# EAGLE design wifi Shield V1.0 (EAGLE 6.1)
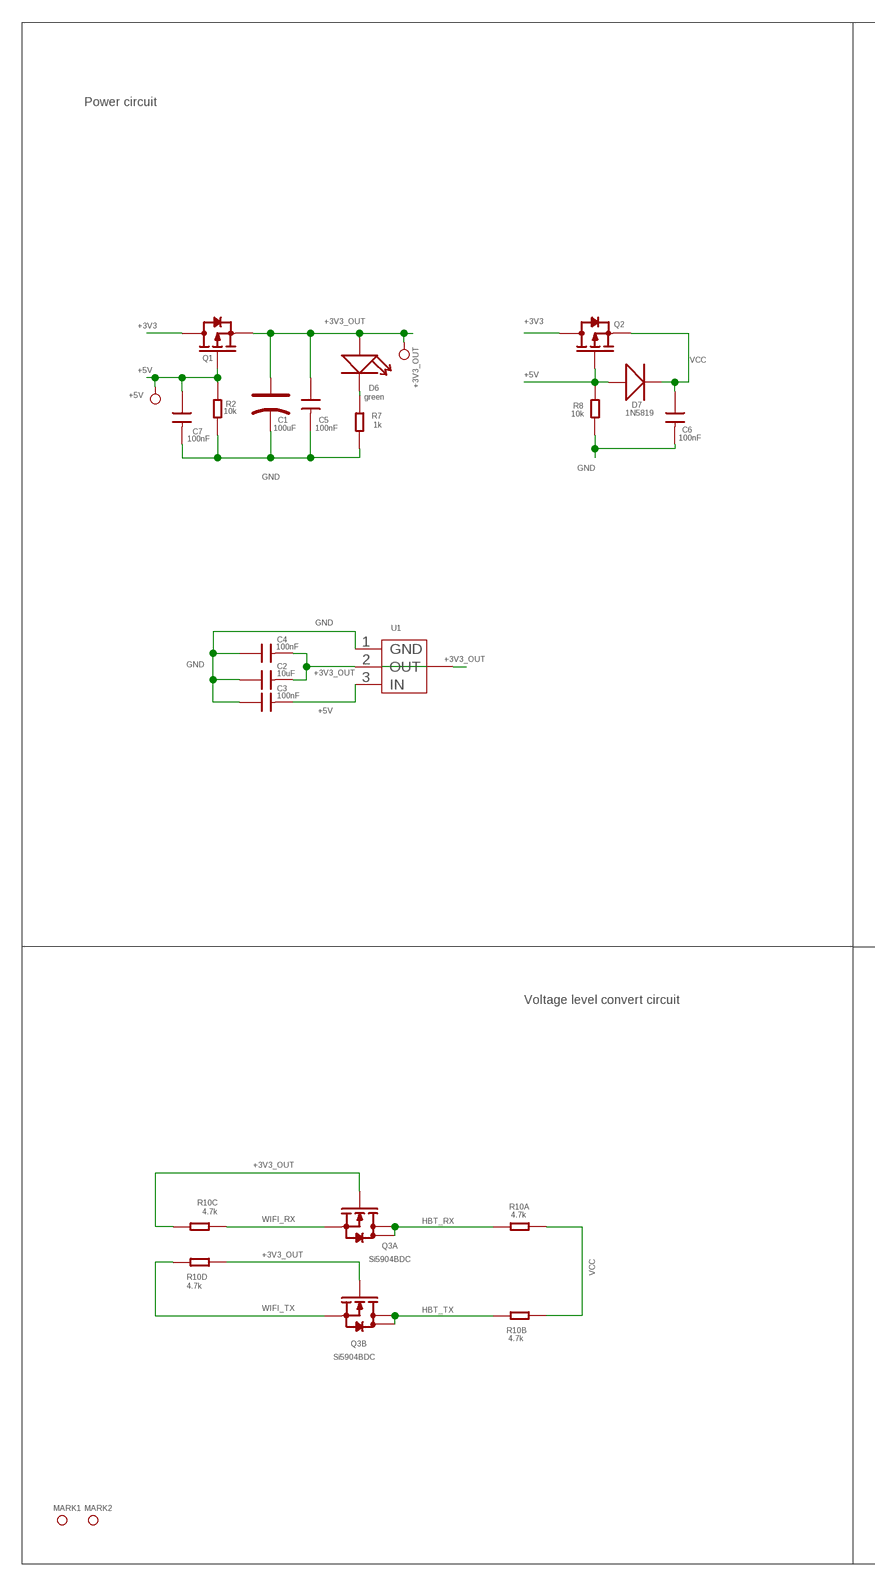
[diagram p0: schematic, sheet 1, part 1 of 2]
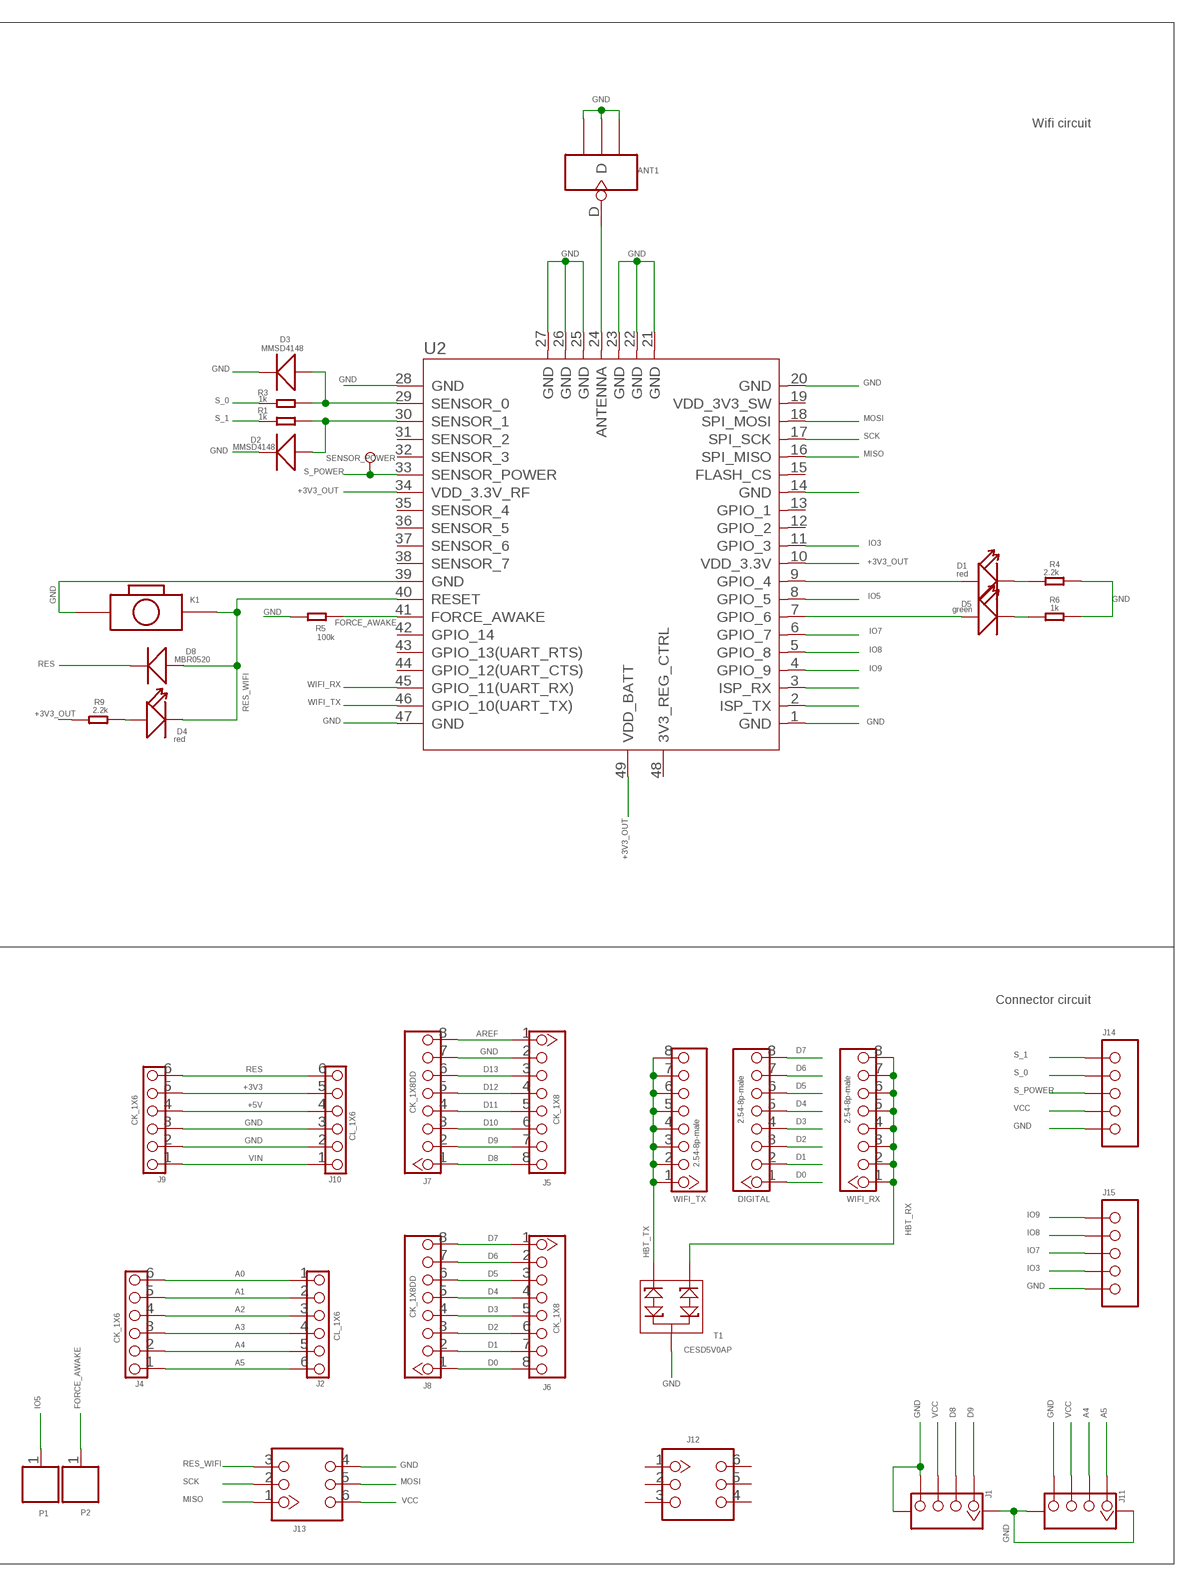
[diagram p1: schematic, sheet 1, part 2 of 2]

## Parts
+3V3_OUT  PAD-TEST-POINT-CIRCLE_SIZE_3030  [TP_3535]
+5V  PAD-TEST-POINT-CIRCLE_SIZE_3030  [TP_3535]
ANT1  ANTENNA-U-FL  [4P-U-FL]
C1  100uF  CAP-AVX-B  [AVX-B]
C2  10uF  C-0603  [0603]
C3  100nF  C-0603  [0603]
C4  100nF  C-0603  [0603]
C5  100nF  C-0603  [0603]
C6  100nF  C-0603  [0603]
C7  100nF  C-0603  [0603]
D1  red  LED'0603'  [LED-0603]
D2  MMSD4148  D-MBR0520LT1  [SOD123-2.7X1.6]
D3  MMSD4148  D-MBR0520LT1  [SOD123-2.7X1.6]
D4  red  LED'0603'  [LED-0603]
D5  green  LED'0603'  [LED-0603]
D6  green  LED'0603'  [LED-0603]
D7  1N5819  D-SMA  [D2010]
D8  MBR0520  D-MBR0520LT1  [SOD123-2.7X1.6]
DIGITAL  2.54-8p-male  HEADER-8P-2.54  [8P-2.54]
J1  TWIG-4P-2.0-SMD-FEMALE-REINFORCE'90D'  [4P-SMD-2.0-90D]
J2  CL_1X6  HEADER-6P-65/35MIL  [6P-2.54-65/35MIL]
J4  CK_1X6  HEADER-6P-65/35MIL  [6P-2.54-65/35MIL]
J5  CK_1X8  HEADER-8P-2.54  [8P-2.54]
J6  CK_1X8  HEADER-8P-2.54  [8P-2.54]
J7  CK_1X8DD  HEADER-8P-2.54  [8P-2.54]
J8  CK_1X8DD  HEADER-8P-2.54  [8P-2.54]
J9  CK_1X6  HEADER-6P-65/35MIL  [6P-2.54-65/35MIL]
J10  CL_1X6  HEADER-6P-65/35MIL  [6P-2.54-65/35MIL]
J11  TWIG-4P-2.0-SMD-FEMALE-REINFORCE'90D'  [4P-SMD-2.0-90D]
J12  HEADER-2X3P-2.54  [2X3P-2.54]
J13  HEADER-2X3P-2.54  [2X3P-2.54]
J14  HEADER-5P-2.54  [5P-2.54]
J15  HEADER-5P-2.54  [5P-2.54]
K1  BOTTON-2P-90  [2P-7.62X3.56-90D]
MARK1  PAD-MARK  [ROUND-MARK-0.635]
MARK2  PAD-MARK  [ROUND-MARK-0.635]
P1  PAD'60/30'  [1P-65/35MIL]
P2  PAD'60/30'  [1P-65/35MIL]
Q1  MOSFET-P'SI2323CDS/SI2305DS<BR>'  [SOT23]
Q2  MOSFET-P'SI2323CDS/SI2305DS<BR>'  [SOT23]
Q3  Si5904BDC  010-DUAL-N-MOSFET_1206-8  [1206-8]
R1  1k  R-0603  [0603]
R2  10k  R-0603  [0603]
R3  1k  R-0603  [0603]
R4  2.2k  R-0603  [0603]
R5  100k  R-0603  [0603]
R6  1k  R-0603  [0603]
R7  1k  R-0603  [0603]
R8  10k  R-0603  [0603]
R9  2.2k  R-0603  [0603]
R10  4.7k  005-4R_1206  [R1206-8]
SENSOR_POWER  PAD-TEST-POINT-CIRCLE_SIZE_3030  [TP_3535]
T1  CESD5V0AP  D-ESD-PESDXL2BT  [SOT23]
U1  LD1117SOT89  [SOT89]
U2  WIFI-RN-171  [49P-1.27-26.67X17.78]
WIFI_RX  2.54-8p-male  HEADER-8P-2.54  [8P-2.54]
WIFI_TX  2.54-8p-male  HEADER-8P-2.54  [8P-2.54]

## Nets
+3V3: J9.5 J10.5 Q1.3(D) Q2.3(D)
+3V3_OUT: +3V3_OUT.T C1.+ C2.2 C4.2 C5.1 D6.+ Q1.2(S) Q3.2(A:G) Q3.4(B:G) R9.2 R10.5 R10.6 U1.2(OUT) U1.4(TAB) U2.10(VDD_3.3V) U2.34(VDD_3.3V_RF) U2.49(VDD_BATT)
+5V: +5V.T C3.2 C7.1 D7.+ J9.4 J10.4 Q1.1(G) Q2.1(G) R2.1 R8.1 U1.3(IN)
A0: J2.1 J4.6
A1: J2.2 J4.5
A2: J2.3 J4.4
A3: J2.4 J4.3
A4: J2.5 J4.2 J11.2
A5: J2.6 J4.1 J11.1
AREF: J5.1 J7.8
D0: DIGITAL.1 J6.8 J8.1
D1: DIGITAL.2 J6.7 J8.2
D2: DIGITAL.3 J6.6 J8.3
D3: DIGITAL.4 J6.5 J8.4
D4: DIGITAL.5 J6.4 J8.5
D5: DIGITAL.6 J6.3 J8.6
D6: DIGITAL.7 J6.2 J8.7
D7: DIGITAL.8 J6.1 J8.8
D8: J1.2 J5.8 J7.1
D9: J1.1 J5.7 J7.2
D10: J5.6 J7.3
D11: J5.5 J7.4
D12: J5.4 J7.5
D13: J5.3 J7.6
FORCE_AWAKE: P2.1 R5.1 U2.41(FORCE_AWAKE)
GND: ANT1.GND1 ANT1.GND2 ANT1.GND3 C1.- C2.1 C3.1 C4.1 C5.2 C6.2 C7.2 D2.1(-) D3.1(-) J1.4 J1.SS1 J1.SS2 J5.2 J7.7 J9.2 J9.3 J10.2 J10.3 J11.4 J11.SS1 J11.SS2 J13.4 J14.5 J15.5 K1.P$2 R2.2 R4.1 R5.2 R6.1 R7.1 R8.2 T1.3 U1.1(GND) U2.1(GND) U2.14(GND) U2.20(GND) U2.21(GND) U2.22(GND) U2.23(GND) U2.25(GND) U2.26(GND) U2.27(GND) U2.28(GND) U2.39(GND) U2.47(GND)
HBT_RX: Q3.7(A:D) Q3.8(A:D) R10.1 T1.1 WIFI_RX.1 WIFI_RX.2 WIFI_RX.3 WIFI_RX.4 WIFI_RX.5 WIFI_RX.6 WIFI_RX.7 WIFI_RX.8
HBT_TX: Q3.5(B:D) Q3.6(B:D) R10.2 T1.2 WIFI_TX.1 WIFI_TX.2 WIFI_TX.3 WIFI_TX.4 WIFI_TX.5 WIFI_TX.6 WIFI_TX.7 WIFI_TX.8
IO3: J15.4 U2.11(GPIO_3)
IO5: P1.1 U2.8(GPIO_5)
IO7: J15.3 U2.6(GPIO_7)
IO8: J15.2 U2.5(GPIO_8)
IO9: J15.1 U2.4(GPIO_9)
MISO: J13.1 U2.16(SPI_MISO)
MOSI: J13.5 U2.18(SPI_MOSI)
N$1: D4.+ R9.1
N$2: D3.2(+) R3.1 U2.29(SENSOR_0)
N$3: D2.2(+) R1.1 U2.30(SENSOR_1)
N$10: U2.2(ISP_TX)
N$11: U2.3(ISP_RX)
N$15: D5.+ U2.7(GPIO_6)
N$20: ANT1.D U2.24(ANTENNA)
N$22: D1.+ U2.9(GPIO_4)
N$23: D5.- R6.2
N$25: D1.- R4.2
N$26: D6.- R7.2
RES: D8.1(-) J9.6 J10.6
RES_WIFI: D4.- D8.2(+) J13.3 K1.P$1 U2.40(RESET)
S_0: J14.2 R3.2
S_1: J14.1 R1.2
S_POWER: J14.3 SENSOR_POWER.T U2.33(SENSOR_POWER)
SCK: J13.2 U2.17(SPI_SCK)
VCC: C6.1 D7.- J1.3 J11.3 J13.6 J14.4 Q2.2(S) R10.7 R10.8
VIN: J9.1 J10.1
WIFI_RX: Q3.1(A:S) R10.3 U2.45(GPIO_11(UART_RX))
WIFI_TX: Q3.3(B:S) R10.4 U2.46(GPIO_10(UART_TX))
Unconnected: J12.1 J12.2 J12.3 J12.4 J12.5 J12.6 U2.12(GPIO_2) U2.13(GPIO_1) U2.15(FLASH_CS) U2.19(VDD_3V3_SW) U2.31(SENSOR_2) U2.32(SENSOR_3) U2.35(SENSOR_4) U2.36(SENSOR_5) U2.37(SENSOR_6) U2.38(SENSOR_7) U2.42(GPIO_14) U2.43(GPIO_13(UART_RTS)) U2.44(GPIO_12(UART_CTS)) U2.48(3V3_REG_CTRL)

## Notes on the sheet
- Power circuit
- Wifi circuit
- Voltage level convert circuit | Connector circuit

## Library data of the parts
+3V3_OUT +5V SENSOR_POWER = Discrete:PAD-TEST-POINT-CIRCLE
ANT1 = Connector:ANTENNA-U-FL
C1 = Discrete:CAP*: Electrolytic Capacitors,Tantalum Capacitors and Super Capacitors
C2-C7 = Discrete:C*: Ceramic Capacitors
D1 D4-D6 = Discrete:LED*
D2 D3 D7 D8 = Discrete:D*
DIGITAL J5-J8 WIFI_RX WIFI_TX = Connector:HEADER-8P
J1 J11 = Connector:TWIG-4P-2.0-SMD-FEMALE-REINFORCE
J2 J4 J9 J10 = Connector:HEADER-6P
J12 J13 = Connector:HEADER-2X3P
J14 J15 = Connector:HEADER-5P
K1 = Discrete:BOTTON-2P
MARK1 MARK2 = Discrete:PAD-MARK
P1 P2 = Discrete:PAD
Q1 Q2 = Discrete:MOSFET-P
Q3 = Discrete:010-DUAL-N-MOSFET*: Si5902BDC Si5904DC Si5908DC Si5920DC
R1-R9 = Discrete:R*
R10 = Discrete:005-4R*: Resistor Array
T1 = Discrete:D-ESD-PESDXL2BT
U1 = IC:LD1117: Low Drop Fixed And Adjustable Positive Voltage Regulators http://www.datasheetcatalog.org/datasheet/SGSThomsonMicroelectronics/mXuqtqv.pdf
U2 = Module:WIFI-RN-171: WIFLY GSX 802.11 b/g wireless LAN Module

## Net classes
0 default: width 0.003 mm, drill 0.254 mm, clearance 0.152 mm

## Board
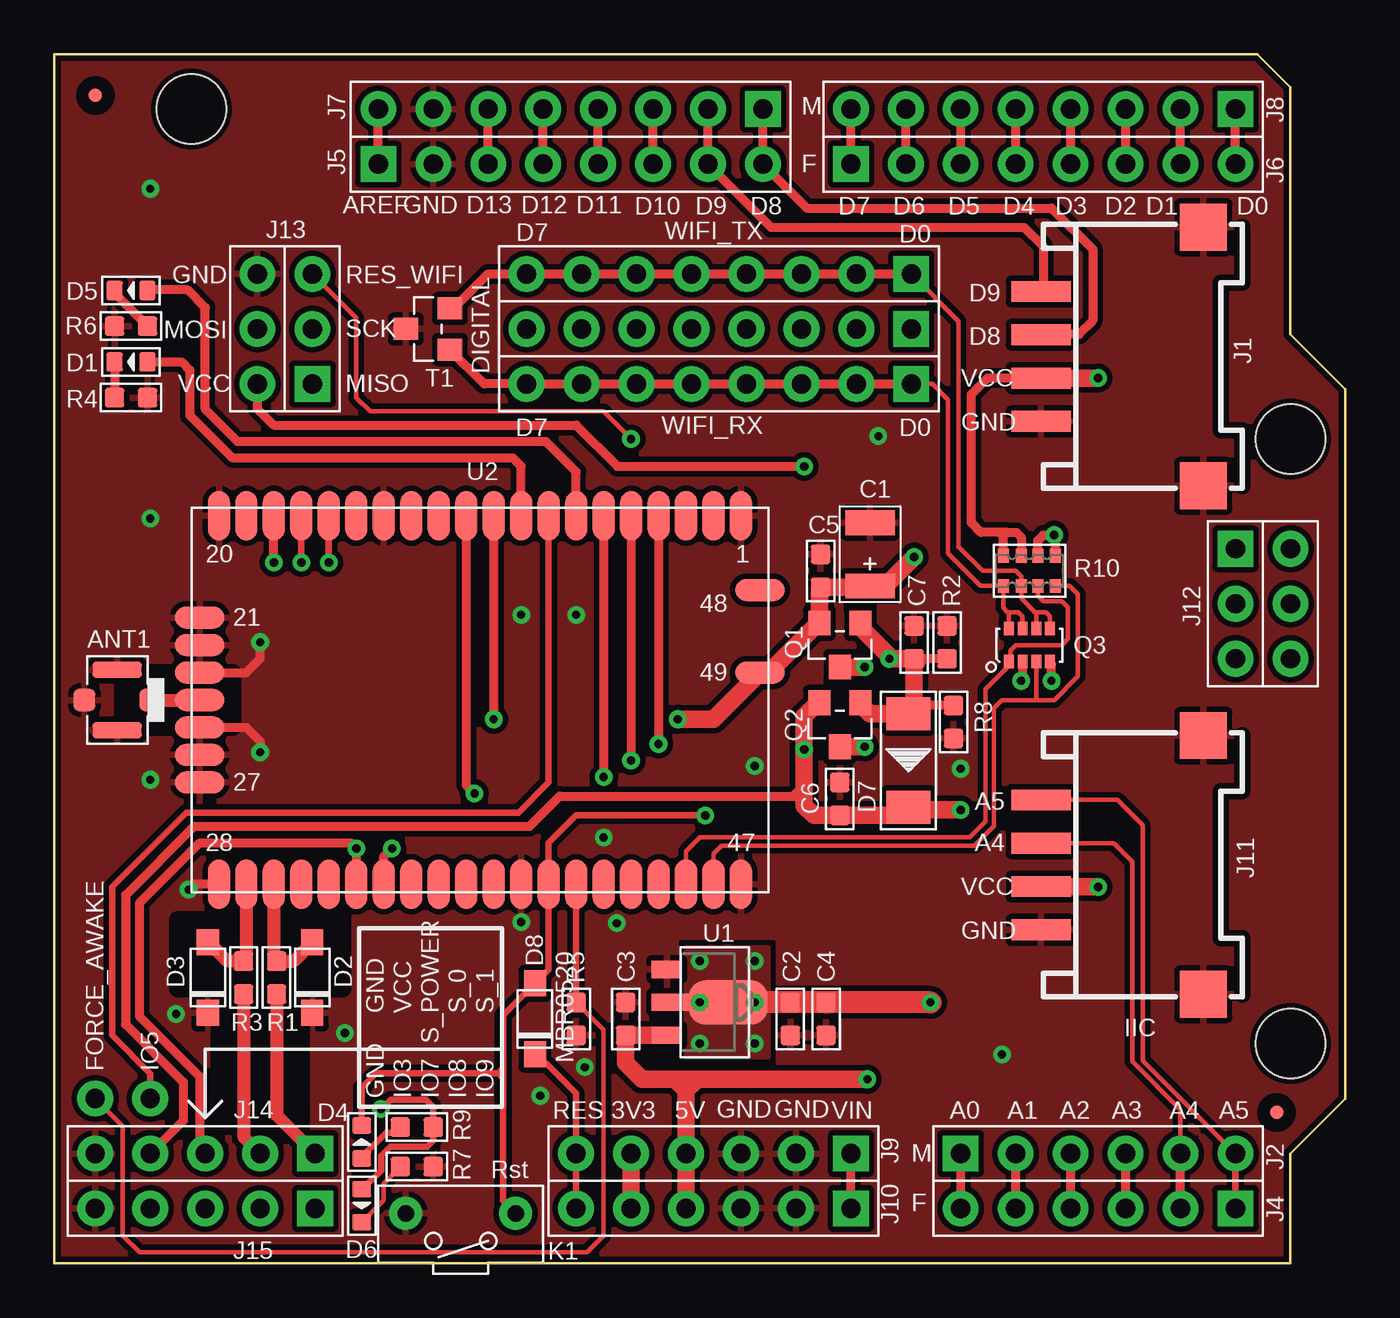
[diagram p2: board, top side]
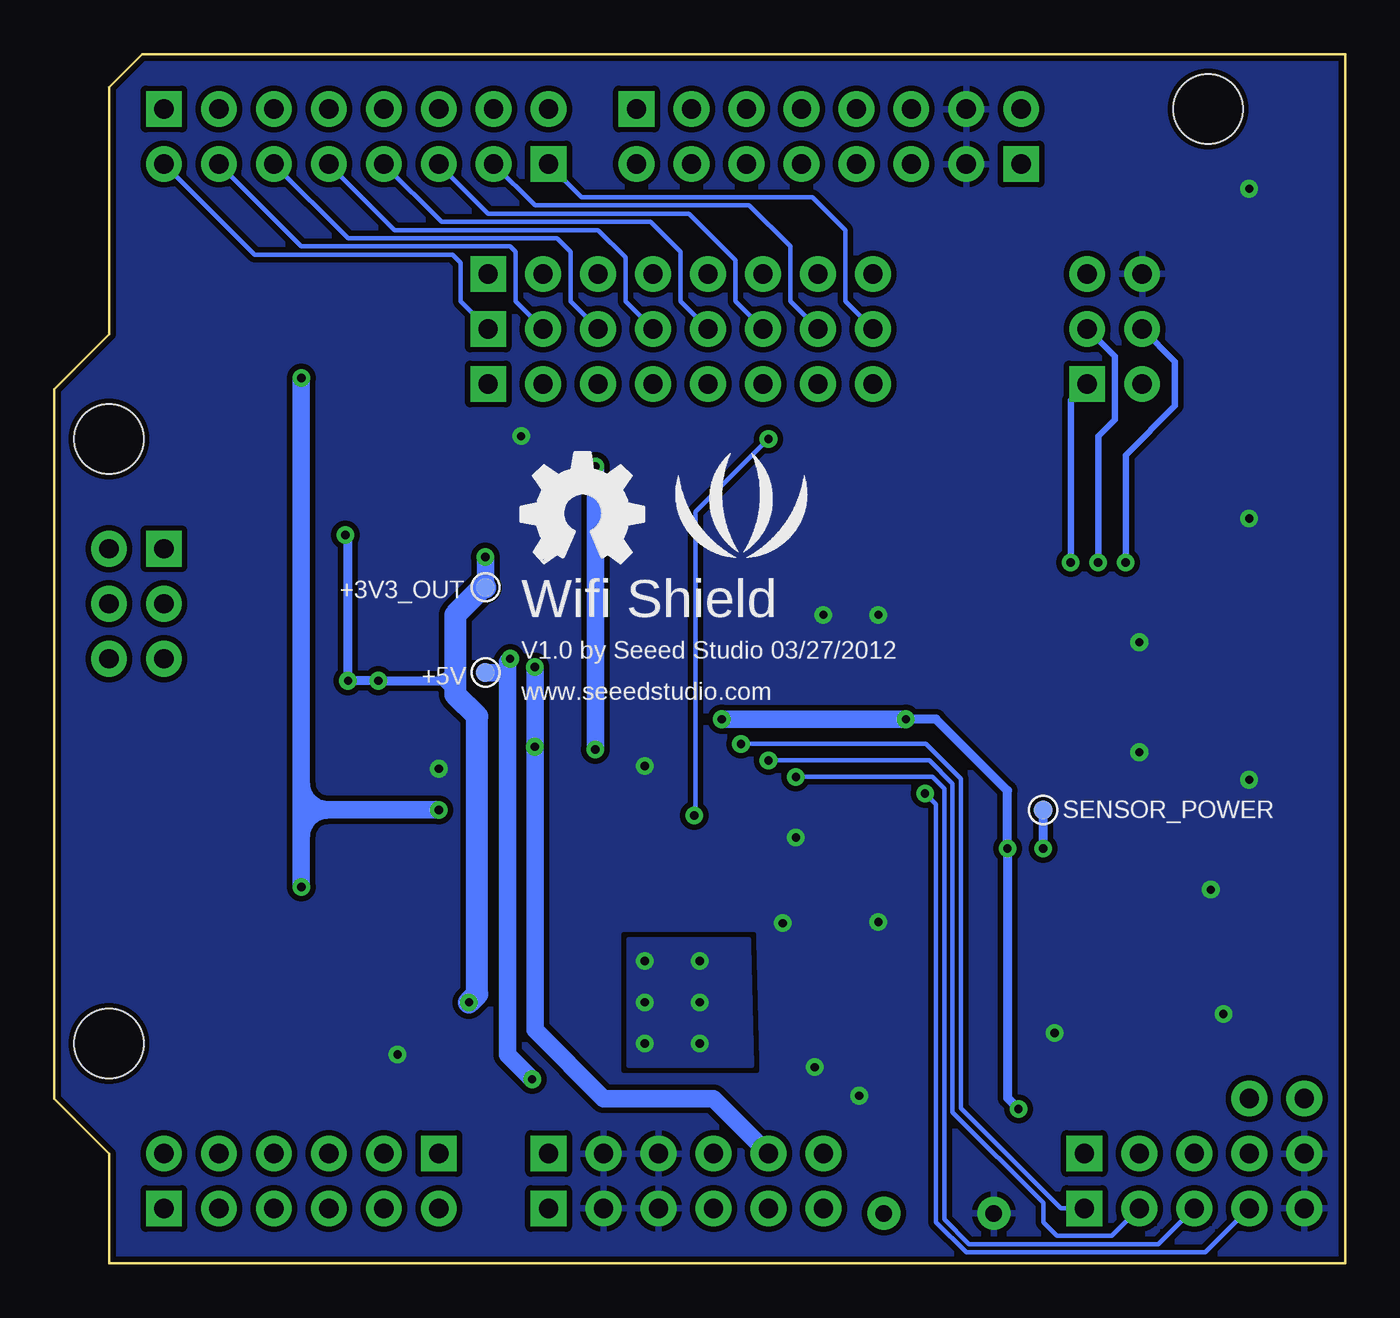
[diagram p3: board, bottom side, seen from below]

Size 59.69 x 55.88 mm. Coordinates in mm from the lower left corner, seen from the top.
Outline: 0,0 0,55.88 55.63,55.88 57.15,54.36 57.15,42.93 59.69,40.39 59.69,7.62 57.15,5.08 57.15,0 0,0
Copper layers (1*16): Top 0.035mm / dielectric 1.5mm / Bottom 0.035mm
Design rules: minimum track width 6mil, minimum drill 12mil, track to track 6mil, track to pad 6mil, pad to pad 6mil, via to via 6mil, smd to smd 0mil, copper to edge 10mil, drill to drill 10mil, minimum pad ring 10mil, minimum via ring 6mil, stop-mask expansion 2mil, vias tented up to drill 32mil, thermal gap 10mil
Holes 3.2 mm at 6.35,53.34 57.15,38.1 57.15,10.16
tRestrict: 16 lines

### Footprints (pad centres in the part's own frame; a part is rotated, then mirrored left to right if it is on the bottom)
TP_3535 = smd 0.889 x 0.889: T 0,0
4P-U-FL = smd 1.016 x 1.016: D -1.524,0; GND3 1.524,0 | smd 2.286 x 0.762: GND1 0,1.397; GND2 0,-1.397
AVX-B = smd 1.143 x 2.286: + -1.46,0; - 1.46,0
0603 = smd 0.889 x 0.889: 1 -0.762,0; 2 0.762,0
LED-0603 = smd 0.762 x 0.889: + -0.762,0; - 0.762,0
SOD123-2.7X1.6 = smd 1.2 x 1.02: 1 -1.635,0; 2 1.635,0
D2010 = smd 1.524 x 2.032: + -2.159,0; - 2.159,0
8P-2.54 = drill 0.889 pad 1.651 square: 1 0,8.89 | drill 0.889 pad 1.651: 2 0,6.35; 3 0,3.81; 4 0,1.27; 5 0,-1.27; 6 0,-3.81; 7 0,-6.35; 8 0,-8.89
4P-SMD-2.0-90D = smd 0.965 x 2.74: 1 -3,-0.1; 2 -1,-0.1; 3 1,-0.1; 4 3,-0.1 | smd 2.159 x 2.184: SS1 -5.974,7.4; SS2 5.974,7.4
6P-2.54-65/35MIL = drill 0.889 pad 1.651 square: 1 0,6.35 | drill 0.889 pad 1.651: 2 0,3.81; 3 0,1.27; 4 0,-1.27; 5 0,-3.81; 6 0,-6.35
2X3P-2.54 = drill 0.889 pad 1.651 square: 1 -1.27,2.54 | drill 0.889 pad 1.651: 2 -1.27,0; 3 -1.27,-2.54; 4 1.27,-2.54; 5 1.27,0; 6 1.27,2.54
5P-2.54 = drill 0.889 pad 1.651 square: 1 0,5.08 | drill 0.889 pad 1.651: 2 0,2.54; 3 0,0; 4 0,-2.54; 5 0,-5.08
2P-7.62X3.56-90D = drill 0.762 pad 1.524: P$1 0,2.54; P$2 0,-2.54
ROUND-MARK-0.635 = smd 0.635 x 0.635: P$1 0,0
1P-65/35MIL = drill 0.889 pad 1.651: 1 0,0
SOT23 = smd 1.016 x 1.143: 1 -0.95,-1.016; 2 0.95,-1.016; 3 0,1.016
1206-8 = smd 0.457 x 0.635: 1 -0.953,-0.762; 2 -0.318,-0.762; 3 0.318,-0.762; 4 0.953,-0.762; 5 0.953,0.762; 6 0.318,0.762; 7 -0.318,0.762; 8 -0.953,0.762
R1206-8 = smd 0.508 x 0.635: 1 -1.206,-0.699; 2 -0.381,-0.699; 3 0.381,-0.699; 4 1.206,-0.699; 5 1.206,0.699; 6 0.381,0.699; 7 -0.381,0.699; 8 -1.206,0.699
SOT89 = smd 0.8 x 1.4: 1 -1.524,-1.905; 3 1.524,-1.905 | smd 0.8 x 1.9: 2 0,-1.651 | smd 2.032 x 3.65: 4 0,0.94
49P-1.27-26.67X17.78 = smd 1.016 x 2.286: 1 12.065,8.509; 2 10.795,8.509; 3 9.525,8.509; 4 8.255,8.509; 5 6.985,8.509; 6 5.715,8.509; 7 4.445,8.509; 8 3.175,8.509; 9 1.905,8.509; 10 0.635,8.509; 11 -0.635,8.509; 12 -1.905,8.509; 13 -3.175,8.509; 14 -4.445,8.509; 15 -5.715,8.509; 16 -6.985,8.509; 17 -8.255,8.509; 18 -9.525,8.509; 19 -10.795,8.509; 20 -12.065,8.509; 28 -12.065,-8.509; 29 -10.795,-8.509; 30 -9.525,-8.509; 31 -8.255,-8.509; 32 -6.985,-8.509; 33 -5.715,-8.509; 34 -4.445,-8.509; 35 -3.175,-8.509; 36 -1.905,-8.509; 37 -0.635,-8.509; 38 0.635,-8.509; 39 1.905,-8.509; 40 3.175,-8.509; 41 4.445,-8.509; 42 5.715,-8.509; 43 6.985,-8.509; 44 8.255,-8.509; 45 9.525,-8.509; 46 10.795,-8.509; 47 12.065,-8.509 | smd 2.286 x 1.016: 21 -12.954,3.81; 22 -12.954,2.54; 23 -12.954,1.27; 24 -12.954,0; 25 -12.954,-1.27; 26 -12.954,-2.54; 27 -12.954,-3.81; 48 12.954,5.08; 49 12.954,1.27

### Placement (x,y rotation side)
+3V3_OUT  39.75,31.24 180 bottom
+5V  39.75,27.3 0 bottom
ANT1  2.92,26.04 180 top
C1  37.72,32.77 90 top
C2  34.04,11.3 90 top
C3  26.42,11.3 270 top
C4  35.69,11.3 90 top
C5  35.43,32 90 top
C6  36.32,21.46 90 top
C7  39.75,28.7 90 top
D1  3.56,41.66 180 top
D2  11.94,13.21 90 top
D3  7.11,13.21 90 top
D4  14.22,5.61 90 top
D5  3.56,44.96 180 top
D6  14.22,2.67 270 top
D7  39.5,23.24 270 top
D8  22.23,11.3 90 top
DIGITAL  30.73,43.18 270 top
J1  45.72,41.91 270 top
J2  48.26,5.08 90 top
J4  48.26,2.54 270 top
J5  23.88,50.8 90 top
J6  45.72,50.8 90 top
J7  23.88,53.34 270 top
J8  45.72,53.34 270 top
J9  30.48,5.08 270 top
J10  30.48,2.54 270 top
J11  45.72,18.41 270 top
J12  55.88,30.48 0 top
J13  10.67,43.18 180 top
J14  6.99,5.08 270 top
J15  6.99,2.54 270 top
K1  18.8,2.31 270 top
MARK1  56.52,6.99 0 top
MARK2  1.91,53.98 0 top
P1  4.45,7.62 0 top
P2  1.91,7.62 0 top
Q1  36.32,28.57 180 top
Q2  36.32,24.89 180 top
Q3  45.09,28.57 0 top
R1  10.29,13.21 270 top
R2  41.27,28.7 90 top
R3  8.76,13.21 270 top
R4  3.56,40.01 180 top
R5  24.13,11.3 270 top
R6  3.56,43.31 0 top
R7  16.76,4.47 180 top
R8  41.58,25.02 270 top
R9  16.76,6.3 0 top
R10  45.09,32 0 top
SENSOR_POWER  13.97,20.95 0 bottom
T1  17.27,43.18 90 top
U1  30.23,12.06 270 top
U2  19.68,26.04 0 top
U$1  [OSHW_FILLX200_NOTEXT]  38.1,32.38 0 bottom
U$2  [LOGO_SILK]  27.94,34.29 0 bottom
WIFI_RX  30.73,40.64 270 top
WIFI_TX  30.73,45.72 270 top

### Tracks (layer width: path | path; a pad name or v marks a point on that pad's centre or on a via)
+3V3  (via drill 0.38 pad 0.81)
  Top 0.813: Q2.3 v37.47,23.88 | v37.47,27.56 Q1.3 | J9.5 J10.5
  Bottom 0.813: v37.47,27.56 v37.47,23.88 37.47,10.79 34.29,7.62 29.21,7.62 J9.5
+3V3_OUT  (via drill 0.38 pad 0.81)
  Top 0.152: Q3.4 46.04,27.75 46.1,27.69
  Top 0.305: D6.+ 14.25,3.43 15.11,4.29 15.11,4.97 15.52,5.38 17.25,5.38 17.53,5.66 R9.2 17.53,7.24 17.2,7.57 15.54,7.57 v15.11,7.14
  Top 0.406: U2.10 v20.32,25.15 | Q3.2 44.77,26.99 v44.7,26.92 | v46.1,26.92 46.1,27.69 | R10.5 46.29,33.59 v46.23,33.66 45.72,33.66 45.47,33.4 R10.6 | U2.34 15.24,18.8 v15.62,19.18
  Top 0.813: v39.75,32.64 38.42,31.3 C1.+ 37.66,31.24 C5.1 35.37,31.18 Q1.2 35.31,29.59 33.02,27.3 U2.49 30.48,25.15 v28.83,25.15 | C4.2 C2.2 v32.38,12.06 U1.4 U1.2
  Top 1.016: v40.51,12.06 C4.2 v32.38,12.06
  Bottom 0.305: 15.47,19.02 v15.62,19.18
  Bottom 0.406: v46.23,33.66 46.1,33.53 v46.1,26.92 v44.7,26.92 41.78,26.92 | 41.15,26.92 41.78,26.92 | 41.78,26.92 41.15,27.56 | 41.78,26.92 41.15,26.29 | v20.32,25.15 18.92,25.15 15.62,21.84 v15.62,19.18 15.62,7.64 v15.11,7.14
  Bottom 0.813: +3V3_OUT.T v39.75,32.64 | v28.83,25.15 v20.32,25.15
  Bottom 1.016: +3V3_OUT.T 39.88,31.24 41.15,29.97 41.15,27.56 41.15,26.92 41.15,26.29 40.13,25.27 40.13,12.45 v40.51,12.06
  other vias: 29.84,13.97 29.84,12.06 29.84,10.16 32.38,10.16 32.38,13.97
  pour Top (isolate 0.254, no thermals): 33.02,14.61 29.21,14.61 29.21,9.53 33.02,9.53
  pour Bottom (isolate 0.254, no thermals): 27.56,14.73 27.56,14.99 33.15,14.99 33.15,9.14 27.43,9.14
+5V  (via drill 0.38 pad 0.81)
  Top 0.152: Q2.1 37.21,25.91
  Top 0.406: R8.1 39.88,25.78 | R2.1 C7.1
  Top 0.813: D7.+ 37.72,25.4 37.21,25.91 | D7.+ 39.75,25.65 C7.1 | 39.88,25.78 D7.+ | 39.88,27.81 C7.1 | C7.1 v38.61,27.94 38.61,28.07 37.34,29.34 37.34,29.46 37.21,29.59 Q1.1 | U1.3 C3.2 26.42,9.27 27.18,8.51 28.7,8.51 | v37.59,8.51 29.08,8.51 | 29.08,8.51 28.7,8.51 | 29.21,8 J9.4 J10.4 | 29.21,8 29.21,8.38 29.08,8.51 | 29.21,8 28.7,8.51 | 29.21,8 29.59,8.38
  Bottom 0.813: v37.59,8.51 38.73,9.65 38.73,27.3 | 38.73,27.3 38.73,27.81 v38.61,27.94 | +5V.T 38.73,27.3
A0
  Top 0.406: J4.6 J2.1
A1
  Top 0.406: J4.5 J2.2
A2
  Top 0.406: J4.4 J2.3
A3
  Top 0.406: J4.3 J2.4
A4
  Top 0.203: J2.5 52.07,7.11 49.84,9.35 49.84,18.57 49.68,18.72 48.98,19.41 J11.2
  Top 0.406: J4.2 J2.5
A5
  Top 0.203: J2.6 50.32,9.37 50.32,20.24 49.15,21.41 J11.1
  Top 0.305: J4.1 J2.6
AREF
  Top 0.406: J5.1 J7.8
D0
  Top 0.406: J6.8 J8.1
  Bottom 0.203: DIGITAL.1 40.89,44.45 40.89,46.23 41.27,46.61 50.42,46.61 J6.8
D1
  Top 0.406: J6.7 J8.2
  Bottom 0.203: DIGITAL.2 38.35,44.45 38.35,46.74 38.61,46.99 48.26,46.99 J6.7
D2
  Top 0.406: J6.6 J8.3
  Bottom 0.203: DIGITAL.3 35.81,44.45 35.81,46.74 36.45,47.37 46.1,47.37 J6.6
D3
  Top 0.406: J6.5 J8.4
  Bottom 0.203: DIGITAL.4 33.27,44.45 33.27,46.48 34.54,47.75 43.94,47.75 J6.5
D4
  Top 0.406: J6.4 J8.5
  Bottom 0.203: DIGITAL.5 30.73,44.45 30.73,46.74 32.13,48.13 41.78,48.13 J6.4
D5
  Top 0.406: J6.3 J8.6
  Bottom 0.203: DIGITAL.6 28.19,44.45 28.19,46.35 30.35,48.51 39.62,48.51 J6.3
D6
  Top 0.406: J6.2 J8.7
  Bottom 0.203: DIGITAL.7 25.65,44.45 25.65,46.99 27.56,48.9 37.47,48.9 J6.2
D7
  Top 0.406: J6.1 J8.8
  Bottom 0.203: DIGITAL.8 23.11,44.45 23.11,47.75 24.64,49.28 35.31,49.28 J6.1
D8
  Top 0.152: J1.2 45.7,42.91 45.72,42.93
  Top 0.406: 45.59,42.93 45.72,42.93 47.37,42.93 48.01,43.56 48.01,46.86 46.1,48.77 34.8,48.77 J5.8 J7.1
D9
  Top 0.406: J1.1 45.72,45.01 45.72,46.99 44.83,47.88 33.15,47.88 J5.7 J7.2
D10
  Top 0.406: J5.6 J7.3
D11
  Top 0.406: J5.5 J7.4
D12
  Top 0.406: J5.4 J7.5
D13
  Top 0.406: J5.3 J7.6
FORCE_AWAKE
  Top 0.203: P2.1 3.17,6.35 3.17,1.28 3.95,0.51 24.64,0.51 25.4,1.27 25.4,10.79 R5.1
  Top 0.305: U2.41 R5.1
GND  (via drill 0.38 pad 0.81)
  Top 0.406: U2.28 6.48,17.53 v6.22,17.27 | U2.23 8.89,27.3 9.53,27.94 v9.53,28.7 | U2.25 8.89,24.77 9.53,24.13 v9.53,23.62
  other vias: 21.59,15.77 26.01,15.72 43.81,9.65 4.45,22.35 4.45,34.42 4.45,49.66 38.1,38.23 21.59,29.97 24.13,29.97 32.38,22.99 25.4,19.68 41.91,22.86 24.54,9.07 13.44,10.64 5.64,11.53 22.48,7.75
  pour Top (isolate 0.254, rank 6): 0,55.88 59.69,55.88 59.69,0 0,0
  pour Bottom (isolate 0.254, rank 6): 0,55.88 59.69,55.88 59.69,0 0,0
HBT_RX
  Top 0.203: 44.07,30.1 44.13,30.04 Q3.8 | 44.07,30.1 43.88,30.29 R10.1 42.82,31.32 41.33,32.81 41.33,39.9 40.59,40.64 WIFI_RX.1 | Q3.7 44.77,29.91 44.58,30.1 44.07,30.1
  Top 0.406: T1.1 19.88,40.64 WIFI_RX.8 WIFI_RX.7 WIFI_RX.6 WIFI_RX.5 WIFI_RX.4 WIFI_RX.3 WIFI_RX.2 WIFI_RX.1
HBT_TX
  Top 0.203: 45.34,30.1 44.7,30.73 R10.2 44.7,31.75 44.45,32 42.93,32 41.81,33.12 41.81,43.54 WIFI_TX.1 | Q3.6 45.4,30.04 45.34,30.1 | 45.34,30.1 45.85,30.1 46.04,29.91 Q3.5
  Top 0.406: T1.2 18.48,44.13 20.07,45.72 WIFI_TX.8 WIFI_TX.7 WIFI_TX.6 WIFI_TX.5 WIFI_TX.4 WIFI_TX.3 WIFI_TX.2 WIFI_TX.1
IO3  (via drill 0.38 pad 0.81)
  Top 0.406: U2.11 19.05,22.1 v19.43,21.72
  Bottom 0.203: J15.4 6.48,0.51 17.53,0.51 18.92,1.91 18.92,21.21 v19.43,21.72
IO5
  Top 0.305: U2.8 22.86,22.23 21.46,20.83 6.1,20.83 2.67,17.41 2.67,10.53 4.45,8.76 P1.1
IO7  (via drill 0.38 pad 0.81)
  Top 0.406: U2.6 v25.4,22.48
  Bottom 0.203: J15.3 8.64,0.89 17.4,0.89 18.54,2.03 18.54,21.94 19.08,22.48 v25.4,22.48
IO8  (via drill 0.38 pad 0.81)
  Top 0.406: U2.5 v26.67,23.24
  Bottom 0.203: J15.2 10.79,1.27 13.34,1.27 13.97,1.91 13.97,2.79 18.16,6.99 18.16,22.16 19.24,23.24 v26.67,23.24
IO9  (via drill 0.38 pad 0.81)
  Top 0.406: U2.4 v27.94,24
  Bottom 0.203: v27.94,24 19.4,24 17.78,22.39 17.78,7.17 13.14,2.54 J15.1
MISO  (via drill 0.38 pad 0.81)
  Top 0.305: v12.7,32.38 U2.16
  Bottom 0.305: J13.1 12.7,39.88 v12.7,32.38
MOSI  (via drill 0.38 pad 0.81)
  Top 0.406: v10.16,32.38 U2.18
  Bottom 0.305: J13.5 7.87,41.66 7.87,39.62 10.16,37.34 v10.16,32.38
N$1
  Top 0.305: D4.+ 14.22,4.93 15.34,6.04 15.75,6.04 R9.1
N$2
  Top 0.152: D3.2 7.11,14.86
  Top 0.61: U2.29 8.89,14.1 R3.1 8,13.97 7.11,14.86
N$3
  Top 0.61: U2.30 10.16,14.1 R1.1 11.06,13.97 D2.2
N$15
  Top 0.406: U2.7 24.13,36.58 22.73,37.97 8.48,37.97 6.99,39.47 6.99,44.17 6.17,44.98 4.32,44.98 | D5.+ 4.32,44.98 | 4.24,44.98 4.32,44.98
N$20
  Top 0.61: ANT1.D U2.24
N$22
  Top 0.406: U2.9 21.59,36.83 21.21,37.21 8.26,37.21 6.27,39.19 6.27,41.27 5.89,41.66 D1.+
N$23
  Top 0.406: D5.- 2.79,44.83 R6.2
N$25
  Top 0.406: D1.- 2.79,40.03 2.77,40.01 R4.2
N$26
  Top 0.203: R7.2 16,4.45 15.24,3.68 15.24,2.92 D6.-
RES
  Top 0.305: D8.1 22.34,9.67 24.13,7.87 J9.6 J10.6
RES_WIFI  (via drill 0.38 pad 0.81)
  Top 0.203: J13.3 13.97,43.69 13.97,40.01 14.61,39.37 25.4,39.37 v26.67,38.1
  Top 0.305: v30.1,20.7 24.13,20.7 22.86,19.43 U2.40 22.86,13.57 D8.2 20.75,11.46 20.75,9.02 | K1.P$1 20.75,2.9 20.75,8.56 | 20.75,8.56 20.75,8.74 | 20.75,8.74 20.75,9.02 | D4.- 14.22,8.13 14.88,8.79 20.32,8.79 20.52,8.79 | 20.75,8.74 20.7,8.79 20.52,8.79 | 20.52,8.79 20.75,9.02 | 20.52,8.79 20.75,8.56
  Bottom 0.203: v26.67,38.1 30.03,34.74 30.03,20.77 v30.1,20.7
S_0
  Top 0.61: R3.2 8.76,5.84 J14.2
S_1
  Top 0.61: R1.2 10.29,6.86 J14.1
S_POWER  (via drill 0.38 pad 0.81)
  Top 0.406: U2.33 v13.97,19.18 13.72,19.43 6.73,19.43 3.94,16.64 3.94,11.43 6.73,8.64 6.73,5.33 J14.3
  Bottom 0.406: v13.97,19.18 SENSOR_POWER.T
SCK  (via drill 0.38 pad 0.81)
  Top 0.305: v11.43,32.38 U2.17
  Bottom 0.305: J13.2 10.67,41.91 10.67,38.99 11.43,38.23 v11.43,32.38
VCC  (via drill 0.38 pad 0.81)
  Top 0.152: Q2.2 35.18,25.91 35.24,25.84 | D7.- 39.5,20.7
  Top 0.305: 43.88,33.59 43.88,33.44 43.87,33.43 43.87,33.53 43.64,33.76
  Top 0.406: J13.6 9.4,39.5 10.16,38.73 24.13,38.73 26.04,36.83 v34.67,36.83 | 44.07,33.78 44.49,33.78 44.7,33.56 R10.7 | R10.8 43.88,33.59 44.07,33.78 | 34.16,21.59 23.37,21.59 21.97,20.19 6.48,20.19 3.3,17.02 3.3,11.05 5.97,8.38 5.97,6.6 J14.4 | 34.29,21.59 34.42,21.59 34.67,21.84 34.42,21.84 34.16,21.59 | 34.16,21.59 34.29,21.59 | 34.29,21.59 34.54,21.34 | 44.07,33.78 42.85,33.78 42.39,34.24 42.39,40.16 43.16,40.92 J1.3
  Top 0.813: 39.5,20.7 C6.1 35.13,20.7 34.67,21.16 34.67,21.84 v34.67,23.75 34.67,25.27 35.24,25.84 35.31,25.91 | v48.26,17.4 45.64,17.4 J11.3 | v48.26,40.91 J1.3 | v41.91,20.95 39.37,20.95 D7.-
  Bottom 0.813: v34.67,23.75 v34.67,36.83 | 48.26,20.95 48.26,22.2 | 48.26,22.2 v48.26,40.91 | v41.91,20.95 47.02,20.95 | 47.02,20.95 48.26,20.95 | v48.26,17.4 48.26,19.71 | 48.26,19.71 48.26,20.95 | 47.02,20.95 arc-90 48.26,19.71 | 47.02,20.95 arc90 48.26,22.2
VIN
  Top 0.406: J10.1 J9.1
WIFI_RX
  Top 0.203: R10.3 45.47,30.86 45.72,30.61 46.58,30.61 46.86,30.32 46.86,28.86 46.58,28.57 44.45,28.57 44.2,28.32 44.2,27.88 Q3.1 44.13,27.62 43.05,26.54 43.05,20.4 42.34,19.68 29.84,19.68 29.21,19.05 U2.45
WIFI_TX
  Top 0.203: R10.4 46.94,31.3 47.33,30.91 47.33,27.12 46.24,26.04 45.47,26.04 | U2.46 30.48,18.92 30.86,19.3 42.54,19.3 43.43,20.2 43.43,25.65 43.81,26.04 45.34,26.04 | 45.34,26.04 45.47,26.04 | Q3.3 45.4,26.1 | 45.4,26.1 45.47,26.04 | 45.4,26.1 45.34,26.04

### Text on the board
tPlace: J7 | M | J8 | J5 | F | J6 | AREF | GND | D13 | D12 | D11 | D10 | D9 | D8 | D7 | D6 | D5 | D4 | D3 | D2 | D1 | D0 | D7 | D0 | GND | RES_WIFI | D9 | MOSI | SCK | D8 | VCC | VCC | MISO | D7 | D0 | GND | A5 | A4 | VCC | GND | GND | VCC | S_0 | S_1 | IIC | S_POWER | FORCE_AWAKE | IO5 | GND | IO3 | IO7 | IO8 | IO9 | RES | 3V3 | 5V | GND | GND | VIN | A0 | A1 | A2 | A3 | A4 | A5 | Rst | M | J2 | F | J4
bPlace: Wifi Shield | V1.0 by Seeed Studio 03/27/2012 | www.seeedstudio.com